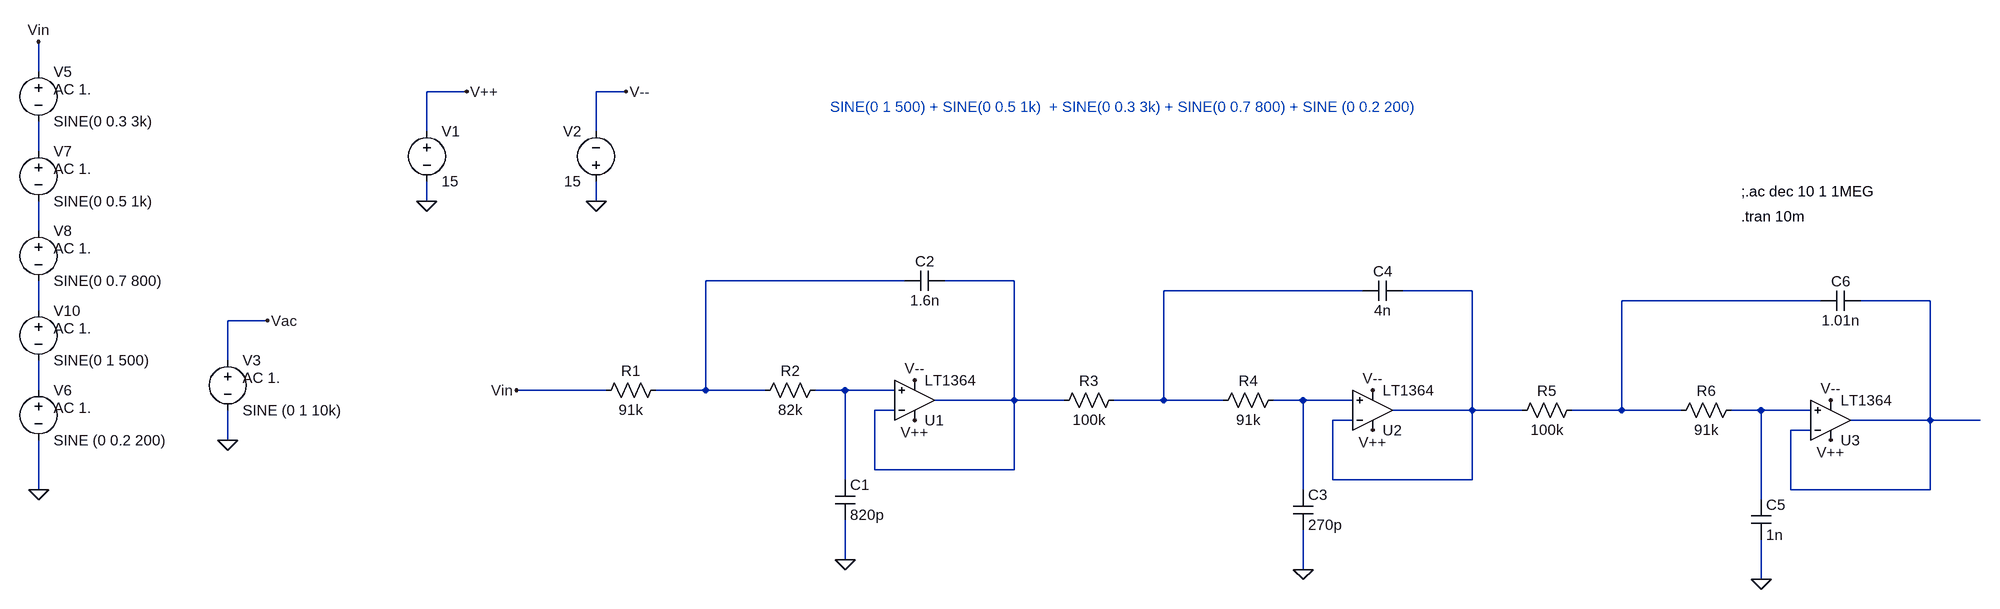
[diagram p0: schematic LT1634_Butterworth_SK_1.asc]
LT1634_Butterworth_SK_1.asc, the LTspice schematic file:
Version 4
SHEET 1 2556 680
WIRE -1104 -784 -1104 -832
WIRE -416 -752 -480 -752
WIRE -160 -752 -208 -752
WIRE -480 -688 -480 -752
WIRE -208 -688 -208 -752
WIRE -1104 -656 -1104 -704
WIRE -480 -576 -480 -608
WIRE -208 -576 -208 -608
WIRE -1104 -528 -1104 -576
WIRE 288 -448 -32 -448
WIRE 464 -448 352 -448
WIRE 1024 -432 704 -432
WIRE 1200 -432 1088 -432
WIRE 1760 -416 1440 -416
WIRE 1936 -416 1824 -416
WIRE -1104 -400 -1104 -448
WIRE -736 -384 -800 -384
WIRE -800 -320 -800 -384
WIRE -1104 -272 -1104 -320
WIRE -192 -272 -336 -272
WIRE -32 -272 -32 -448
WIRE -32 -272 -112 -272
WIRE 64 -272 -32 -272
WIRE 192 -272 144 -272
WIRE 272 -272 192 -272
WIRE 464 -256 464 -448
WIRE 464 -256 336 -256
WIRE 544 -256 464 -256
WIRE 704 -256 704 -432
WIRE 704 -256 624 -256
WIRE 800 -256 704 -256
WIRE 928 -256 880 -256
WIRE 1008 -256 928 -256
WIRE 272 -240 240 -240
WIRE 1200 -240 1200 -432
WIRE 1200 -240 1072 -240
WIRE 1280 -240 1200 -240
WIRE 1440 -240 1440 -416
WIRE 1440 -240 1360 -240
WIRE 1536 -240 1440 -240
WIRE 1664 -240 1616 -240
WIRE 1744 -240 1664 -240
WIRE 1008 -224 976 -224
WIRE 1936 -224 1936 -416
WIRE 1936 -224 1808 -224
WIRE 2016 -224 1936 -224
WIRE 1744 -208 1712 -208
WIRE -800 -192 -800 -240
WIRE 240 -144 240 -240
WIRE 464 -144 464 -256
WIRE 464 -144 240 -144
WIRE 192 -128 192 -272
WIRE 976 -128 976 -224
WIRE 1200 -128 1200 -240
WIRE 1200 -128 976 -128
WIRE -1104 -112 -1104 -192
WIRE 928 -112 928 -256
WIRE 1712 -112 1712 -208
WIRE 1936 -112 1936 -224
WIRE 1936 -112 1712 -112
WIRE 1664 -96 1664 -240
WIRE 192 0 192 -64
WIRE 928 16 928 -48
WIRE 1664 32 1664 -32
FLAG 192 0 0
FLAG -480 -576 0
FLAG -208 -576 0
FLAG -416 -752 V++
FLAG -160 -752 V--
FLAG 304 -288 V--
FLAG 304 -224 V++
FLAG -800 -192 0
FLAG 928 16 0
FLAG 1040 -272 V--
FLAG 1040 -208 V++
FLAG 1664 32 0
FLAG 1776 -256 V--
FLAG 1776 -192 V++
FLAG -1104 -832 Vin
FLAG -736 -384 Vac
FLAG -336 -272 Vin
FLAG -1104 -112 0
SYMBOL Opamps\\LT1364 304 -192 M180
SYMATTR InstName U1
SYMBOL res -96 -288 R90
WINDOW 0 0 56 VBottom 2
WINDOW 3 32 56 VTop 2
SYMATTR InstName R1
SYMATTR Value 91k
SYMBOL res 160 -288 R90
WINDOW 0 0 56 VBottom 2
WINDOW 3 32 56 VTop 2
SYMATTR InstName R2
SYMATTR Value 82k
SYMBOL cap 176 -128 R0
SYMATTR InstName C1
SYMATTR Value 820p
SYMBOL voltage -480 -704 R0
WINDOW 123 0 0 Left 0
WINDOW 39 0 0 Left 0
SYMATTR InstName V1
SYMATTR Value 15
SYMBOL voltage -208 -592 R180
WINDOW 0 24 96 Left 2
WINDOW 3 24 16 Left 2
SYMATTR InstName V2
SYMATTR Value 15
SYMBOL cap 352 -464 R90
WINDOW 0 0 32 VBottom 2
WINDOW 3 32 32 VTop 2
SYMATTR InstName C2
SYMATTR Value 1.6n
SYMBOL voltage -800 -336 R0
WINDOW 123 24 44 Left 2
WINDOW 39 0 0 Left 0
SYMATTR Value2 AC 1.
SYMATTR InstName V3
SYMATTR Value SINE (0 1 10k)
SYMBOL Opamps\\LT1364 1040 -176 M180
SYMATTR InstName U2
SYMBOL res 640 -272 R90
WINDOW 0 0 56 VBottom 2
WINDOW 3 32 56 VTop 2
SYMATTR InstName R3
SYMATTR Value 100k
SYMBOL res 896 -272 R90
WINDOW 0 0 56 VBottom 2
WINDOW 3 32 56 VTop 2
SYMATTR InstName R4
SYMATTR Value 91k
SYMBOL cap 912 -112 R0
SYMATTR InstName C3
SYMATTR Value 270p
SYMBOL cap 1088 -448 R90
WINDOW 0 0 32 VBottom 2
WINDOW 3 32 32 VTop 2
SYMATTR InstName C4
SYMATTR Value 4n
SYMBOL Opamps\\LT1364 1776 -160 M180
SYMATTR InstName U3
SYMBOL res 1376 -256 R90
WINDOW 0 0 56 VBottom 2
WINDOW 3 32 56 VTop 2
SYMATTR InstName R5
SYMATTR Value 100k
SYMBOL res 1632 -256 R90
WINDOW 0 0 56 VBottom 2
WINDOW 3 32 56 VTop 2
SYMATTR InstName R6
SYMATTR Value 91k
SYMBOL cap 1648 -96 R0
SYMATTR InstName C5
SYMATTR Value 1n
SYMBOL cap 1824 -432 R90
WINDOW 0 0 32 VBottom 2
WINDOW 3 32 32 VTop 2
SYMATTR InstName C6
SYMATTR Value 1.01n
SYMBOL voltage -1104 -800 R0
WINDOW 123 24 44 Left 2
WINDOW 39 0 0 Left 0
SYMATTR Value2 AC 1.
SYMATTR InstName V5
SYMATTR Value SINE(0 0.3 3k)
SYMBOL voltage -1104 -288 R0
WINDOW 123 24 44 Left 2
WINDOW 39 0 0 Left 0
SYMATTR Value2 AC 1.
SYMATTR InstName V6
SYMATTR Value SINE (0 0.2 200)
SYMBOL voltage -1104 -672 R0
WINDOW 123 24 44 Left 2
WINDOW 39 0 0 Left 0
SYMATTR Value2 AC 1.
SYMATTR InstName V7
SYMATTR Value SINE(0 0.5 1k)
SYMBOL voltage -1104 -544 R0
WINDOW 123 24 44 Left 2
WINDOW 39 0 0 Left 0
SYMATTR Value2 AC 1.
SYMATTR InstName V8
SYMATTR Value SINE(0 0.7 800)
SYMBOL voltage -1104 -416 R0
WINDOW 123 24 44 Left 2
WINDOW 39 0 0 Left 0
SYMATTR Value2 AC 1.
SYMATTR InstName V10
SYMATTR Value SINE(0 1 500)
TEXT 1632 -592 Left 2 !;.ac dec 10 1 1MEG
TEXT 1632 -552 Left 2 !.tran 10m
TEXT 168 -728 Left 2 ;SINE(0 1 500) + SINE(0 0.5 1k)  + SINE(0 0.3 3k) + SINE(0 0.7 800) + SINE (0 0.2 200)

The netlist it stands for:
* LT1634_Butterworth_SK_1.asc
XU1 N011 N004 V++ V-- N004 LT1363  ; LT1364, pins In+ In- V+ V- OUT
R1 N003 Vin 91k
R2 N011 N003 82k
C1 N011 0 820p
V1 V++ 0 15
V2 0 V-- 15
C2 N004 N003 1.6n
V3 Vac 0 SINE (0 1 10k) AC 1.
XU2 N012 N006 V++ V-- N006 LT1363  ; LT1364, pins In+ In- V+ V- OUT
R3 N005 N004 100k
R4 N012 N005 91k
C3 N012 0 270p
C4 N006 N005 4n
XU3 N013 N008 V++ V-- N008 LT1363  ; LT1364, pins In+ In- V+ V- OUT
R5 N007 N006 100k
R6 N013 N007 91k
C5 N013 0 1n
C6 N008 N007 1.01n
V5 Vin N001 SINE(0 0.3 3k) AC 1.
V6 N010 0 SINE (0 0.2 200) AC 1.
V7 N001 N002 SINE(0 0.5 1k) AC 1.
V8 N002 N009 SINE(0 0.7 800) AC 1.
V10 N009 N010 SINE(0 1 500) AC 1.
;.ac dec 10 1 1MEG
.tran 10m
* SINE(0 1 500) + SINE(0 0.5 1k)  + SINE(0 0.3 3k) + SINE(0 0.7 800) + SINE (0 0.2 200)
.lib LTC.lib
.backanno
.end